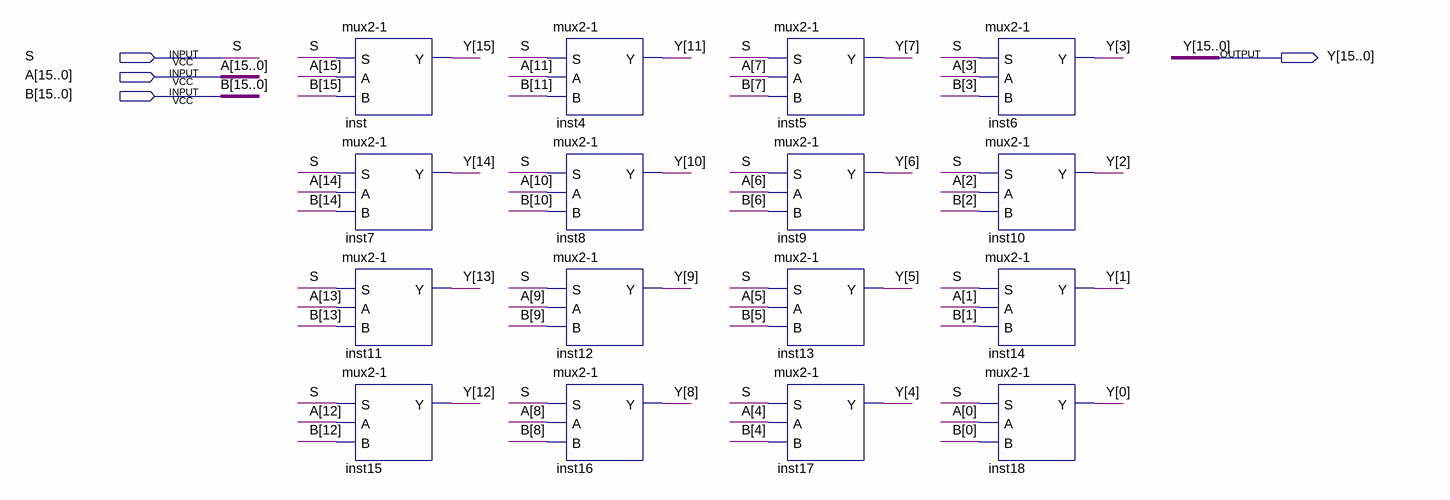
[diagram p0: schematic sheet]
// Quartus schematic mux2-1_16bit.bdf as structural Verilog: 16 symbols, 4 pins
module \mux2-1_16bit  (
  input  S,
  input  [15:0] A,
  input  [15:0] B,
  output [15:0] Y
);

  \mux2-1  inst (.S(S), .A(A[15]), .B(B[15]), .Y(Y[15]));
  \mux2-1  inst7 (.S(S), .A(A[14]), .B(B[14]), .Y(Y[14]));
  \mux2-1  inst11 (.S(S), .A(A[13]), .B(B[13]), .Y(Y[13]));
  \mux2-1  inst15 (.S(S), .A(A[12]), .B(B[12]), .Y(Y[12]));
  \mux2-1  inst4 (.S(S), .A(A[11]), .B(B[11]), .Y(Y[11]));
  \mux2-1  inst8 (.S(S), .A(A[10]), .B(B[10]), .Y(Y[10]));
  \mux2-1  inst12 (.S(S), .A(A[9]), .B(B[9]), .Y(Y[9]));
  \mux2-1  inst16 (.S(S), .A(A[8]), .B(B[8]), .Y(Y[8]));
  \mux2-1  inst5 (.S(S), .A(A[7]), .B(B[7]), .Y(Y[7]));
  \mux2-1  inst9 (.S(S), .A(A[6]), .B(B[6]), .Y(Y[6]));
  \mux2-1  inst13 (.S(S), .A(A[5]), .B(B[5]), .Y(Y[5]));
  \mux2-1  inst17 (.S(S), .A(A[4]), .B(B[4]), .Y(Y[4]));
  \mux2-1  inst6 (.S(S), .A(A[3]), .B(B[3]), .Y(Y[3]));
  \mux2-1  inst10 (.S(S), .A(A[2]), .B(B[2]), .Y(Y[2]));
  \mux2-1  inst14 (.S(S), .A(A[1]), .B(B[1]), .Y(Y[1]));
  \mux2-1  inst18 (.S(S), .A(A[0]), .B(B[0]), .Y(Y[0]));
endmodule
